# Altium schematic sheet 2312_Communication.SchDoc
size A4; Organization: ETML-ES; Address1: Avenue Recordon 1; Address2: 1004 Lausanne; Address3: Switzerland; SheetNumber: 5; SheetTotal: 7
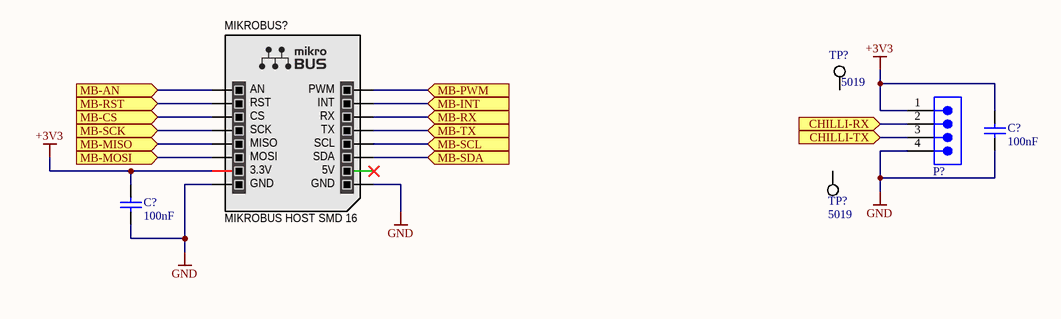
[diagram p0: 2312_Communication.SchDoc]

## Parts
(Parts that share a designator on the sheet are numbered #1, #2 ... from top to bottom, then left to right.)
C?#1  100nF  [WCAP-CSGP_0805_L2W1.25H0.8_Reflow]
C?#2  100nF  [WCAP-CSGP_0805_L2W1.25H0.8_Reflow]
MIKROBUS?  MIKROBUS HOST SMD 16  [MIKROBUS HOST SMD 16 - Black]
P?  62000411622  [62000411622]  (value not drawn)
TP?#1  5019  [KSTN-5019_V]
TP?#2  5019  [KSTN-5019_V]

## Ports
CHILLI-RX (in), CHILLI-TX (in), MB-AN (in), MB-CS (in), MB-INT (in), MB-MISO (in), MB-MOSI (in), MB-PWM (in), MB-RST (in), MB-RX (in), MB-SCK (in), MB-SCL (in), MB-SDA (in), MB-TX (in)

## Nets
+3V3: C?#1.2 C?#2.2 MIKROBUS?.7(3.3V) P?.1
GND: C?#1.1 C?#2.1 MIKROBUS?.8(GND) MIKROBUS?.9(GND) P?.4
CHILLI-RX: P?.2 ; port CHILLI-RX
CHILLI-TX: P?.3 ; port CHILLI-TX
MB-AN: MIKROBUS?.1(AN) ; port MB-AN
MB-CS: MIKROBUS?.3(CS) ; port MB-CS
MB-INT: MIKROBUS?.15(INT) ; port MB-INT
MB-MISO: MIKROBUS?.5(MISO) ; port MB-MISO
MB-MOSI: MIKROBUS?.6(MOSI) ; port MB-MOSI
MB-PWM: MIKROBUS?.16(PWM) ; port MB-PWM
MB-RST: MIKROBUS?.2(RST) ; port MB-RST
MB-RX: MIKROBUS?.14(RX) ; port MB-RX
MB-SCK: MIKROBUS?.4(SCK) ; port MB-SCK
MB-SCL: MIKROBUS?.12(SCL) ; port MB-SCL
MB-SDA: MIKROBUS?.11(SDA) ; port MB-SDA
MB-TX: MIKROBUS?.13(TX) ; port MB-TX

Not connected (* = marked no-connect by the designer): MIKROBUS? 10(5V)*; TP?#1 1; TP?#2 1

## Notes on the sheet
- Fichier :
- a
- Date :
- Heure :
- Version :
- Auteur :
- Modif.
- b
- c
- d
- Projet :
- No :
- Nb feuilles
- Feuille n°
- Chemin :

## Library data of the parts
C?#1 C?#2 = 885012207016: WCAP-CSGP Multilayer Ceramic Chip Capacitor, General Purpose, size 0805, X7R, 100nF, 10VDC; Manufacturer: Wurth Elektronik; Case/Size Code: 0805; Capacitance Tolerance: +/-10%; Dissipation Factor: 5%; Insulation Resistance: 5GΩ; Rated Voltage (DC): 10V; Technical Reference: X7R0805104K010DFCT10000; Manufacturer Part Number: 885012207016; Category: Multilayer Ceramic Chip Capacitors; Match Code: WCAP-CSGP; ComponentLink1Description: Website Link; ComponentLink1URL: https://www.we-online.com/redexpert/article/885012207016?ad; ComponentLink2Description: Datasheet Link; ComponentLink2URL: https://www.we-online.com/redexpert/spec/885012207016?ad; Mount: Surface Mount; Operating Temperature Max: 125°C; Operating Temperature Min: -55°C; Packaging: Tape and Reel; Length: 2mm; Width: 1.25mm; Height: 0.8mm; Capacitance: 100nF; Ceramic Type: X7R
MIKROBUS? = MIKROBUS HOST CONN
P? = 62000411622: WR-WTB Male Vertical Shrouded Header, pitch 2mm, 4pins; Manufacturer: Wurth Elektronik; Contact Resistance: 20mΩ; Rated Current: 2A; Working Voltage: 125VAC; Withstanding Voltage: 800VAC; ComponentLink1Description: Website Link; ComponentLink1URL: https://www.we-online.com/redexpert/article/62000411622?ad; ComponentLink2Description: Datasheet Link; ComponentLink2URL: https://www.we-online.com/redexpert/spec/62000411622?ad; Manufacturer Part Number: 62000411622; Category: Wire-to-Board Connectors; Match Code: WR-WTB; Mount: Through Hole; Operating Temperature Max: 85°C; Operating Temperature Min: -25°C; Packaging: Bag; Length: 10mm; Width: 4.7mm; Height: 6.1mm; Gender: Male; Number of Pins: 4; Number of Rows: 1; Orientation: Vertical; Pitch: 2mm
TP?#1 TP?#2 = CMP-1672-00008-1: Test Point, 1 Position SMD, RoHS, Tape and Reel; ComponentLink1Description: Manufacturer URL; Package Quantity: 1000; DatasheetVersion: 03/2014; Packaging: Tape and Reel; ComponentLink2URL: http://www.keyelco.com/product-pdf.cfm?p=1357; ComponentLink1URL: http://www.keyelco.com/; Mount: Surface Mount; Contact Plating: Silver; PackageDescription: 1-Pin Surface Mount Device, Body 3.81 x 2.03 mm; Pins: 1; RoHSCompliant: True; Mounting Technology: Surface Mount; ComponentLink2Description: Datasheet; PackageReference: 5019